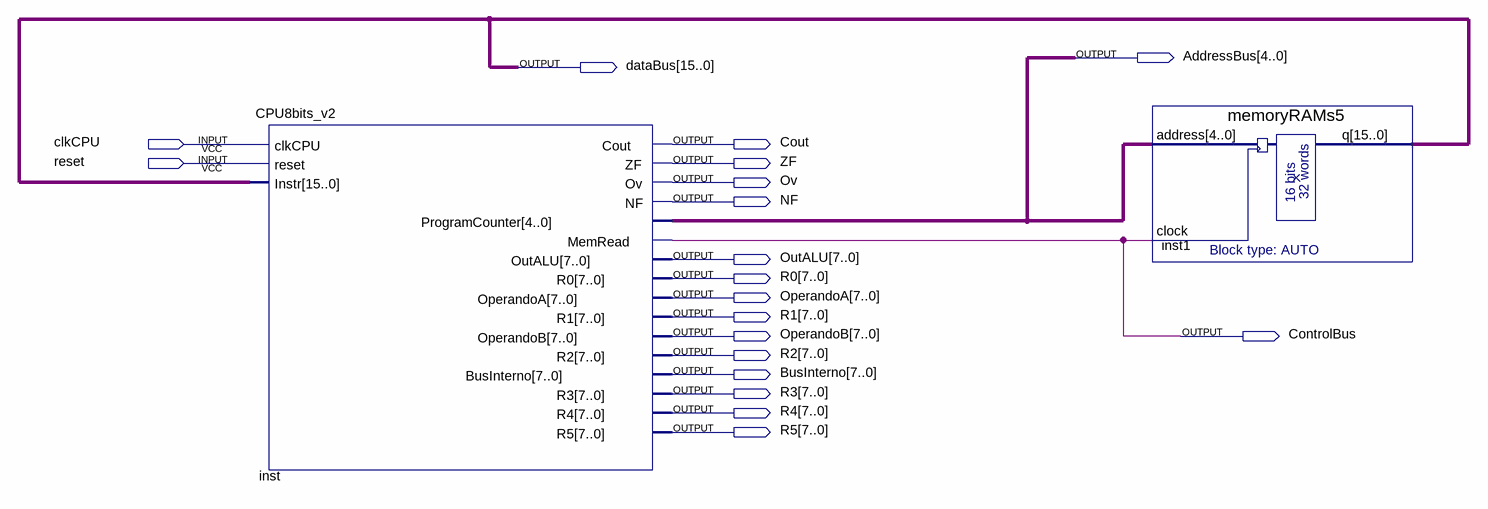
[diagram p0: schematic sheet]
// Quartus schematic ComputadorBasicoFinal.bdf as structural Verilog: 2 symbols, 19 pins
module ComputadorBasicoFinal (
  input  clkCPU,
  input  reset,
  output [4:0] AddressBus,
  output [15:0] dataBus,
  output Cout,
  output ZF,
  output Ov,
  output NF,
  output [7:0] OutALU,
  output [7:0] R0,
  output [7:0] OperandoA,
  output [7:0] R1,
  output [7:0] OperandoB,
  output ControlBus,
  output [7:0] R2,
  output [7:0] BusInterno,
  output [7:0] R3,
  output [7:0] R4,
  output [7:0] R5
);

  CPU8bits_v2 inst (
    .clkCPU(clkCPU), .reset(reset), .Instr(dataBus), .Cout(Cout), .ZF(ZF), .Ov(Ov), .NF(NF),
    .ProgramCounter(AddressBus), .MemRead(ControlBus), .OutALU(OutALU), .R0(R0), .OperandoA(OperandoA),
    .R1(R1), .OperandoB(OperandoB), .R2(R2), .BusInterno(BusInterno), .R3(R3), .R4(R4), .R5(R5));
  memoryRAMs5 inst1 (.address(AddressBus), .clock(ControlBus), .q(dataBus));
endmodule
